# EAGLE board MainLogger (EAGLE 9.6.2), part 1 of 2
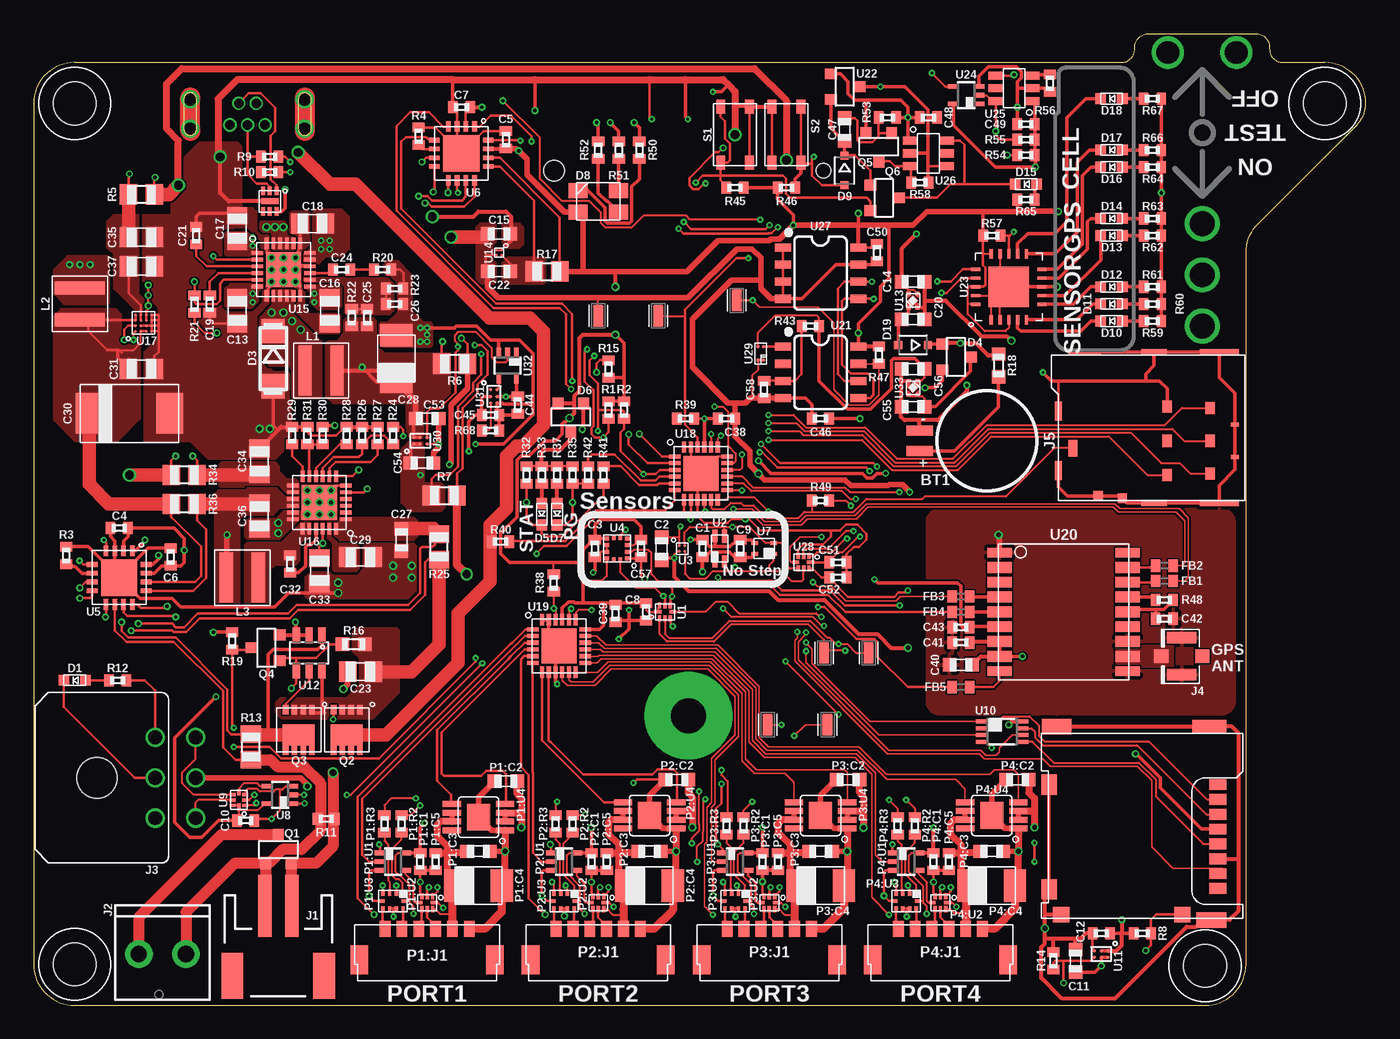
[diagram p7: board, top side]
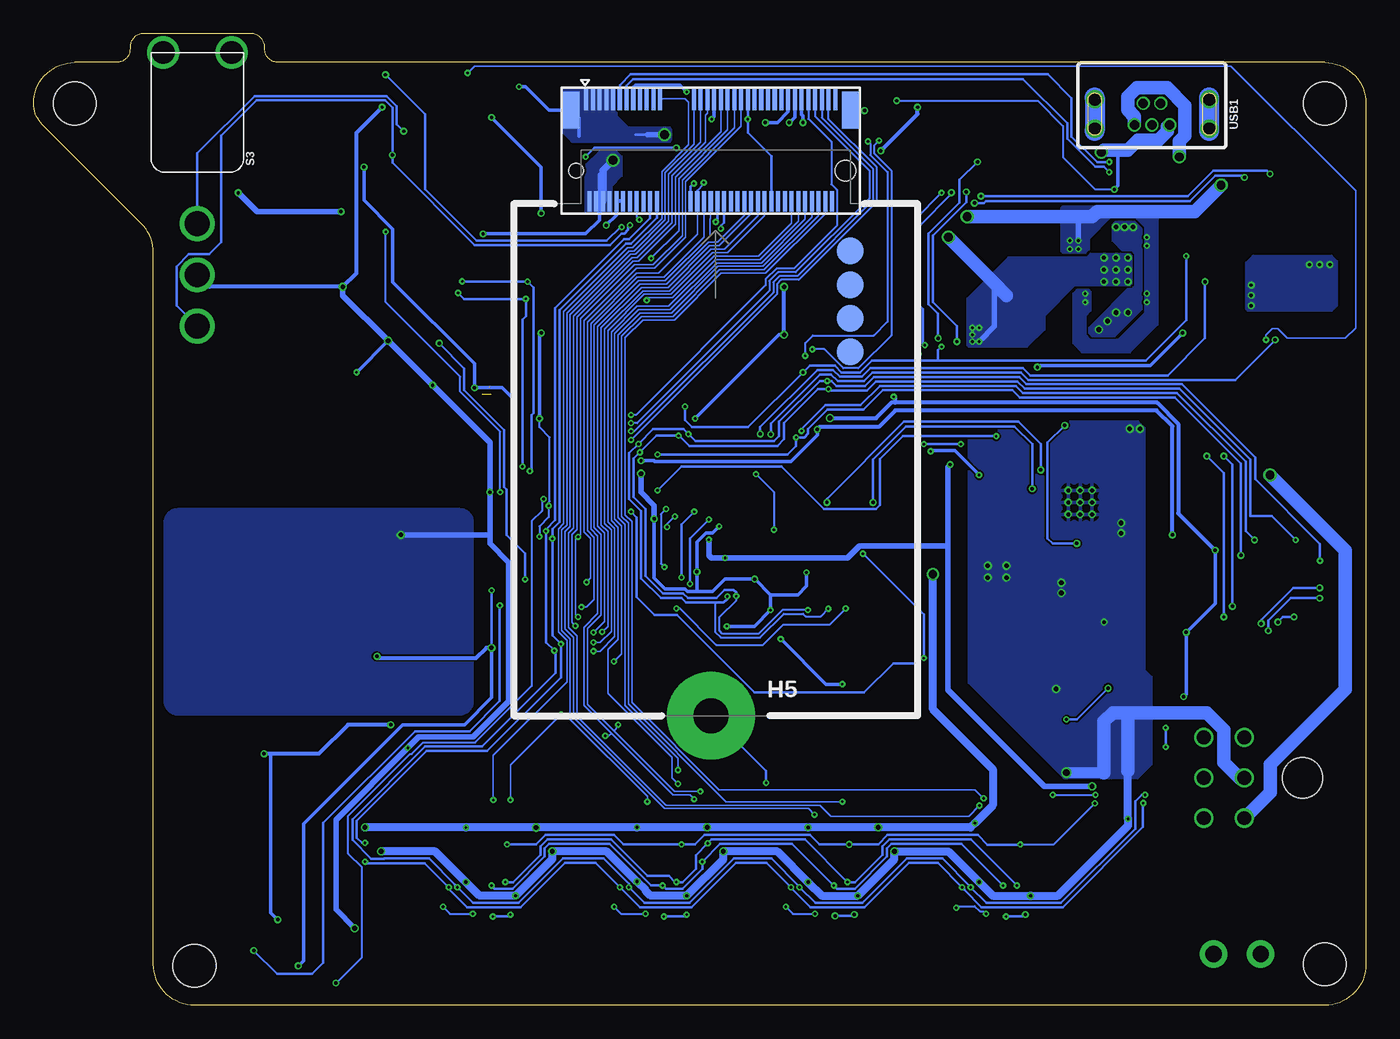
[diagram p8: board, bottom side, seen from below]

Size 98.89 x 72.14 mm. Coordinates in mm from the lower left corner, seen from the top.
Outline: 90.89,58.04 98.25,65.39 arc45 98.89,66.95 arc90 95.84,70 92.74,70 arc-90 91.74,71 91.74,71.14 arc90 90.74,72.14 82.74,72.14 arc90 81.74,71.14 81.74,71 arc-90 80.74,70 3.05,70 arc90 0,66.95 0,3.05 arc90 3.05,0 86.95,0 arc90 90,3.05 90,55.89 arc-45 90.89,58.04
Copper layers (1*16): Top 0.035559375mm / dielectric 1.6mm / Bottom 0.035559375mm
Design rules "jlcpcb-2layer *": minimum track width 5mil, minimum drill 0.2mm, track to track 5mil, track to pad 5mil, pad to pad 5mil, via to via 6mil, smd to smd 5mil, copper to edge 0.2mm, drill to drill 6mil, minimum pad ring 5mil, minimum via ring 5mil, stop-mask expansion 2.5mil, vias tented up to drill 0mil, thermal gap 10mil

## Footprints (pad centres in the part's own frame; a part is rotated, then mirrored left to right if it is on the bottom)
PARTICLE_M.2EKEY = smd 0.3 x 1.55: 1 -9.62,3.735; 2 -9.37,-3.815; 3 -9.12,3.735; 4 -8.87,-3.815; 5 -8.62,3.735; 6 -8.37,-3.815; 7 -8.12,3.735; 8 -7.87,-3.815; 9 -7.62,3.735; 10 -7.37,-3.815; 11 -7.12,3.735; 12 -6.87,-3.815; 13 -6.62,3.735; 14 -6.37,-3.815; 15 -6.12,3.735; 16 -5.87,-3.815; 17 -5.62,3.735; 18 -5.37,-3.815; 19 -5.12,3.735; 20 -4.87,-3.815; 21 -4.62,3.735; 22 -4.37,-3.815; 23 -4.12,3.735; 32 -1.87,-3.815; 33 -1.62,3.735; 34 -1.37,-3.815; 35 -1.12,3.735; 36 -0.87,-3.815; 37 -0.62,3.735; 38 -0.37,-3.815; 39 -0.12,3.735; 40 0.13,-3.815; 41 0.38,3.735; 42 0.63,-3.815; 43 0.88,3.735; 44 1.13,-3.815; 45 1.38,3.735; 46 1.63,-3.815; 47 1.88,3.735; 48 2.13,-3.815; 49 2.38,3.735; 50 2.63,-3.815; 51 2.88,3.735; 52 3.13,-3.815; 53 3.38,3.735; 54 3.63,-3.815; 55 3.88,3.735; 56 4.13,-3.815; 57 4.38,3.735; 58 4.63,-3.815; 59 4.88,3.735; 60 5.13,-3.815; 61 5.38,3.735; 62 5.63,-3.815; 63 5.88,3.735; 64 6.13,-3.815; 65 6.38,3.735; 66 6.63,-3.815; 67 6.88,3.735; 68 7.13,-3.815; 69 7.38,3.735; 70 7.63,-3.815; 71 7.88,3.735; 72 8.13,-3.815; 73 8.38,3.735; 74 8.63,-3.815; 75 8.88,3.735 | smd 1.2 x 2.75: 76 9.98,2.96; 77 -10.72,2.96 | smd 2 x 2: !RESET 10,-7.5; SWCLK 10,-15; SWDIO 10,-12.5; SWO 10,-10 | drill 2.6 pad 6.5: GND -0.351,-42 | hole 1.1: -10.37,-1.54 | hole 1.55: 9.63,-1.54
ML621S = smd 0.75 x 2: + 0.75,1; - -0.75,1
C0402 = smd 0.7 x 0.9: 1 -0.65,0; 2 0.65,0
C0603 = smd 1 x 1: 1 -0.85,0; 2 0.85,0
C0805 = smd 1.3 x 1.5: 1 -0.95,0; 2 0.95,0
C1411_TANT = smd 1.65 x 2.4: ANODE -1.725,0; CATHODE 1.725,0
C2917 = smd 2 x 3: + -3,0; - 3,0
LED_0603 = smd 0.8 x 0.8: ANODE 0.8,0; CATHODE -0.8,0
DFN_6_1.6X1.6 = smd 0.3 x 0.63: 1 -0.5,-0.76; 2 0,-0.76; 3 0.5,-0.76; 4 0.5,0.76; 5 0,0.76; 6 -0.5,0.76 | smd 1.3 x 0.45: EP 0,0
DO214AC = smd 1.8 x 1.7: A 2.05,0; C -2.05,0
SOT23-3 = smd 0.8 x 0.9: 1 -0.95,-1; 2 0.95,-1; 3 0,1.1
CLVBA-FKA = smd 1.4 x 1.1: 1 -1.5,0.8; 2 -1.5,-0.8; 3 1.5,-0.8; 4 1.5,0.8
SOD323-R = smd 0.6 x 0.6: A 1.1,0; C -1.1,0
R0402 = smd 0.7 x 0.9: 1 -0.65,0; 2 0.65,0
4_40 = hole 3.175: 0,0
JST-2-SMD = smd 1 x 4.6: 1 -1,-3.7; 2 1,-3.7 | smd 1.6 x 3.4: NC1 -3.4,1.5; NC2 3.4,1.5
SCREWTERMINAL-3.5MM-2_ROUND_RESTRICT = drill 1.2 pad 2.032: 1 0,0; 2 3.5,0
2X3_MICROFIT_RT = drill 1.02: 1 3,4.32; 2 0,4.32; 3 -3,4.32; 4 3,7.32; 5 0,7.32; 6 -3,7.32 | hole 3: 0,0
U.FL = smd 2.2 x 0.85: 1 0,1.375; 2 0,-1.375 | smd 1.05 x 1: FEED 1.525,0; NC -1.525,0
SIM_SF72 = smd 0.9 x 0.7: 1 2.44,2.6; 2 0,2.6; 3 -2.44,2.6; 5 2.54,5.77; 6 0,5.77; 7 -2.54,5.77 | smd 0.7 x 0.7: CSW -4.27,9.1 | smd 1.2 x 0.65: DSW -0.55,12.775 | smd 0.45 x 2.9: GND@1 -4.62,1.9; GND@8 6.58,1.9 | smd 0.45 x 1.9: GND@2 -4.62,6.75; GND@7 6.58,6.75 | smd 0.75 x 0.7: GND@3 -4.095,10.9 | smd 1.4 x 0.5: GND@4 -2.2,13.85; GND@5 2.2,13.85 | smd 0.45 x 2.4: GND@6 6.58,11.9 | smd 0.3 x 0.6: GND@9 1.22,0.75; GND@10 -1.22,0.75
WE-MAIA(4.1X4.1) = smd 0.98 x 3.7: P$1 -1.185,0; P$2 1.185,0
WE-MAPI(4.1X4.1) = smd 0.98 x 3.7: P$1 -1.185,0; P$2 1.185,0
1X06_MICROLOCKPLUS_RT = smd 0.8 x 1.2: 1 -3.125,-0.6; 2 -1.875,-0.6; 3 -0.625,-0.6; 4 0.625,-0.6; 5 1.875,-0.6; 6 3.125,-0.6 | smd 1.3 x 2.15: BODY@1 -5.025,1.695; BODY@2 5.025,1.695
DCK_R-PDSO-G5 = smd 0.35 x 0.8: 1 -0.65,-0.95; 2 0,-0.95; 3 0.65,-0.95; 4 0.65,0.95; 5 -0.65,0.95
UQFN-8_1.4X1.2 = smd 0.55 x 0.25: 1 -0.53,0 | smd 0.25 x 0.45: 2 -0.4,-0.475; 3 0,-0.475; 4 0.4,-0.475; 6 0.4,0.475; 7 0,0.475; 8 -0.4,0.475 | smd 0.45 x 0.25: 5 0.58,0
MICROPAK_10 = smd 0.25 x 0.35: 1 -0.75,-0.56; 2 -0.25,-0.56; 3 0.25,-0.56; 4 0.75,-0.56; 6 0.75,0.56; 7 0.25,0.56; 8 -0.25,0.56; 9 -0.75,0.56 | smd 0.35 x 0.25: 5 0.81,0; 10 -0.81,0
MSOP_8EP = smd 1.35 x 0.45: 1 -1.975,0.975; 2 -1.975,0.325; 3 -1.975,-0.325; 4 -1.975,-0.975; 5 1.975,-0.975; 6 1.975,-0.325; 7 1.975,0.325; 8 1.975,0.975 | smd 1.7 x 2: EP 0,0
POWERDI3333-8 = smd 0.42 x 0.7: 1 -0.975,-1.5; 2 -0.325,-1.5; 3 0.325,-1.5; 4 0.975,-1.5; EP@1 0.975,1.5; EP@2 0.325,1.5; EP@3 -0.325,1.5; EP@4 -0.975,1.5 | smd 2.37 x 1.55: EP@5 0,0.381
R0805 = smd 1.3 x 1.5: 1 -0.95,0; 2 0.95,0
R0603 = smd 1 x 1: 1 -0.85,0; 2 0.85,0
SWITCH_4.2X3.2 = smd 1.05 x 0.65: 1 -2.075,1.075; 2 2.075,1.075; 3 -2.075,-1.075; 4 2.075,-1.075
7103K2CWAV2 = drill 1.85: 1 0,12.7; 2 0,16.51; 3 0,20.32 | drill 1.7: BODY@1 -2.54,0; BODY@2 2.54,0
MICROSD_MOLEX_5031821852 = smd 0.8 x 1.24: 1 0,-0.62; 2 1.1,-0.62; 3 2.2,-0.62; 4 3.3,-0.62; 5 4.4,-0.62; 6 5.5,-0.62; 7 6.6,-0.62; 8 7.7,-0.62 | smd 0.95 x 2.5: BODY@1 -4.345,-1.24 | smd 1.15 x 2.2: BODY@2 -4.305,-12.58; BODY@5 10.045,-1.1 | smd 1.5 x 1.15: BODY@3 0,-13.155; BODY@4 7.78,-13.155 | smd 1.16 x 1.2: SW1 9.64,-12.25; SW2 9.64,-3.25
TESTPOINT_0603 = smd 1.6 x 0.8: 1 0,0
VEML6075 = smd 0.9 x 0.35: 1 -0.95,0.35; 2 -0.95,-0.35; 4 0.95,0.35 | smd 1 x 0.35: 3 0.9,-0.35
BGA_4 = smd 0.23 x 0.23: A1 -0.2,0.2; A2 0.2,0.2; B1 -0.2,-0.2; B2 0.2,-0.2
LGA-12_2X2 = smd 0.3 x 0.35: 1 -0.75,-0.775; 2 -0.25,-0.775; 3 0.25,-0.775; 4 0.75,-0.775; 7 0.75,0.775; 8 0.25,0.775; 9 -0.25,0.775; 10 -0.75,0.775 | smd 0.3 x 0.25: 5 0.8,-0.25; 6 0.8,0.25; 11 -0.8,0.25; 12 -0.8,-0.25
QFN16 = smd 0.8 x 0.35: 1 -2,0.975; 2 -2,0.325; 3 -2,-0.325; 4 -2,-0.975; 9 2,-0.975; 10 2,-0.325; 11 2,0.325; 12 2,0.975 | smd 0.35 x 0.8: 5 -0.975,-2; 6 -0.325,-2; 7 0.325,-2; 8 0.975,-2; 13 0.975,2; 14 0.325,2; 15 -0.325,2; 16 -0.975,2 | smd 2.7 x 2.7: EP 0,0
SHT4X = smd 0.5 x 0.3: 1 -0.7,0.4; 2 -0.7,-0.4; 3 0.7,-0.4; 4 0.7,0.4
DCU_(R-PDSO-G8) = smd 0.3 x 0.8: 1 -0.75,-1.55; 2 -0.25,-1.55; 3 0.25,-1.55; 4 0.75,-1.55; 5 0.75,1.55; 6 0.25,1.55; 7 -0.25,1.55; 8 -0.75,1.55
WCSP_6 = smd 0.25 x 0.25: A1 -0.25,0.5; A2 0.25,0.5; B1 -0.25,0; B2 0.25,0; C1 -0.25,-0.5; C2 0.25,-0.5
SOT23-6L = smd 0.55 x 1.2: 1 -0.95,-1.3; 2 0,-1.3; 3 0.95,-1.3; 4 0.95,1.3; 5 0,1.3; 6 -0.95,1.3
X2SON = smd 0.28 x 0.31: 1 -0.52,0.325; 2 -0.52,-0.325; 3 0.52,-0.325; 4 0.52,0.325 | smd 0.58 x 0.58 rotated 45: EP 0,0
YKE0004 = smd 0.18 x 0.18: A1 -0.175,0.175; A2 0.175,0.175; B1 -0.175,-0.175; B2 0.175,-0.175
QFN24_POWER = smd 0.85 x 0.28: 1 -1.95,1.25; 2 -1.95,0.75; 3 -1.95,0.25; 4 -1.95,-0.25; 5 -1.95,-0.75; 6 -1.95,-1.25; 13 1.95,-1.25; 14 1.95,-0.75; 15 1.95,-0.25; 16 1.95,0.25; 17 1.95,0.75; 18 1.95,1.25 | smd 0.28 x 0.85: 7 -1.25,-1.95; 8 -0.75,-1.95; 9 -0.25,-1.95; 10 0.25,-1.95; 11 0.75,-1.95; 12 1.25,-1.95; 19 1.25,1.95; 20 0.75,1.95; 21 0.25,1.95; 22 -0.25,1.95; 23 -0.75,1.95; 24 -1.25,1.95 | smd 2.6 x 2.6: EP 0,0 | drill 0.3: EP@1 -0.889,0.889; EP@2 0,0.889; EP@3 0.889,0.889; EP@4 -0.889,0; EP@5 0,0; EP@6 0.889,0; EP@7 -0.889,-0.889; EP@8 0,-0.889; EP@9 0.889,-0.889
YFP0016 = smd 0.23 x 0.23: A1 -0.6,0.6; A2 -0.2,0.6; A3 0.2,0.6; A4 0.6,0.6; B1 -0.6,0.2; B2 -0.2,0.2; B3 0.2,0.2; B4 0.6,0.2; C1 -0.6,-0.2; C2 -0.2,-0.2; C3 0.2,-0.2; C4 0.6,-0.2; D1 -0.6,-0.6; D2 -0.2,-0.6; D3 0.2,-0.6; D4 0.6,-0.6
QFN24 = smd 0.85 x 0.3: 1 -1.95,1.25; 2 -1.95,0.75; 3 -1.95,0.25; 4 -1.95,-0.25; 5 -1.95,-0.75; 6 -1.95,-1.25; 13 1.95,-1.25; 14 1.95,-0.75; 15 1.95,-0.25; 16 1.95,0.25; 17 1.95,0.75; 18 1.95,1.25 | smd 0.3 x 0.85: 7 -1.25,-1.95; 8 -0.75,-1.95; 9 -0.25,-1.95; 10 0.25,-1.95; 11 0.75,-1.95; 12 1.25,-1.95; 19 1.25,1.95; 20 0.75,1.95; 21 0.25,1.95; 22 -0.25,1.95; 23 -0.75,1.95; 24 -1.25,1.95 | smd 2.6 x 2.6: EP 0,0
MAX-M8 = smd 1.8 x 0.7: 1 -4.75,4.4; 9 -4.75,-4.4; 10 4.75,-4.4; 18 4.75,4.4 | smd 1.8 x 0.8: 2 -4.75,3.3; 3 -4.75,2.2; 4 -4.75,1.1; 5 -4.75,0; 6 -4.75,-1.1; 7 -4.75,-2.2; 8 -4.75,-3.3; 11 4.75,-3.3; 12 4.75,-2.2; 13 4.75,-1.1; 14 4.75,0; 15 4.75,1.1; 16 4.75,2.2; 17 4.75,3.3
SO08 = smd 0.6 x 1.2: 1 -1.905,-2.8; 2 -0.635,-2.8; 3 0.635,-2.8; 4 1.905,-2.8; 5 1.905,2.8; 6 0.635,2.8; 7 -0.635,2.8; 8 -1.905,2.8
QFN20_5X5 = smd 0.7 x 0.25: 1 -2.45,1.3; 2 -2.45,0.65; 3 -2.45,0; 4 -2.45,-0.65; 5 -2.45,-1.3; 11 2.45,-1.3; 12 2.45,-0.65; 13 2.45,0; 14 2.45,0.65; 15 2.45,1.3 | smd 0.25 x 0.7: 6 -1.3,-2.45; 7 -0.65,-2.45; 8 0,-2.45; 9 0.65,-2.45; 10 1.3,-2.45; 16 1.3,2.45; 17 0.65,2.45; 18 0,2.45; 19 -0.65,2.45; 20 -1.3,2.45 | smd 3 x 3: EP 0,0
DDC_R-PDSO-G6 = smd 0.6 x 1.1: 1 -0.95,-1.35; 2 0,-1.35; 3 0.95,-1.35; 4 0.95,1.35; 5 0,1.35; 6 -0.95,1.35
LD-4 = smd 0.25 x 0.25: 1 -0.5,-0.205; 2 0.5,-0.205; 3 0.5,0.205; 4 -0.5,0.205
MUSB-K152-30 = drill 0.7: 1 -1.3,0.8; 2 -0.65,-0.8; 3 0,0.8; 4 0.65,-0.8; 5 1.3,0.8 | drill 0.95: BODY@1 -4.25,1.1; BODY@2 -4.25,-1.1; BODY@3 4.25,-1.1; BODY@4 4.25,1.1

## Placement (x,y rotation side)
$3_190_$_2021-12-10_02-09-55  B_SERIES_M.2EKEY_3042  [PARTICLE_M.2EKEY]  48.26,63.5 0 bottom
BT1  BATTERY_COINML621  [ML621S]  64.77,41.91 270 top
C1  0.1uF  [C0402]  49.66,33.91 270 top
C2  2.2uF  [C0603]  46.61,33.91 90 top
C3  0.1uF  [C0402]  41.66,33.91 270 top
C4  0.1uF  [C0402]  6.35,35.43 180 top
C5  0.1uF  [C0402]  35.05,64.26 90 top
C6  0.1uF  [C0402]  10.16,33.27 90 top
C7  0.1uF  [C0402]  31.75,66.67 180 top
C8  0.1uF  [C0402]  45.47,29.21 270 top
C9  0.1uF  [C0402]  52.45,33.91 270 top
C10  0.1uF  [C0402]  15.75,13.72 0 top
C11  1uF  [C0603]  77.34,3.3 90 top
C12  0.1uF  [C0402]  79.25,5.33 180 top
C13  22uF  [C0805]  15.11,51.56 270 top
C14  1uF  [C0603]  65.28,53.72 0 top
C15  1uF  [C0603]  34.54,57.28 180 top
C16  22uF  [C0805]  21.97,51.56 270 top
C17  22uF  [C0805]  15.11,57.66 90 top
C18  22uF  [C0805]  20.7,58.04 180 top
C19  1nF  [C0402]  13.08,52.07 270 top
C20  1uF  [C0603]  65.28,50.93 0 top
C21  10nF  [C0402]  12.06,57.15 90 top
C22  1uF  [C0603]  34.54,54.48 180 top
C23  10uF  [C0805]  24.26,24.77 180 top
C24  39pF  [C0402]  22.86,54.61 0 top
C25  10nF  [C0402]  24.77,51.05 90 top
C26  100pF  [C0402]  26.8,52.07 0 top
C27  1uF  [C0603]  27.3,34.54 270 top
C28  100uF  [C1411_TANT]  26.92,48.01 90 top
C29  10uF  [C0805]  24.26,33.27 0 top
C30  220uF  [C2917]  7.11,43.94 0 top
C31  1.5uF  [C0805]  8,47.24 0 top
C32  47nF  [C0402]  19.05,32.77 270 top
C33  4.7uF  [C0805]  21.21,32.26 270 top
C34  22uF  [C0805]  16.76,40.39 90 top
C35  10uF  [C0805]  8,57.02 0 top
C36  10uF  [C0805]  16.76,36.32 270 top
C37  10uF  [C0805]  8,54.86 0 top
C38  0.1uF  [C0402]  51.44,43.56 0 top
C39  0.1uF  [C0402]  43.18,29.08 270 top
C40  1uF  [C0603]  68.83,25.27 180 top
C41  0.1uF  [C0402]  68.83,26.92 180 top
C42  47pF  [C0402]  83.95,28.7 0 top
C43  0.1uF  [C0402]  68.83,28.07 180 top
C44  0.1uF  [C0402]  35.94,44.58 270 top
C45  0.1uF  [C0402]  33.91,43.81 0 top
C46  0.1uF  [C0402]  58.42,43.56 180 top
C47  1uF  [C0603]  60.2,65.02 90 top
C48  0.1uF  [C0402]  66.42,65.91 0 top
C49  0.1uF  [C0402]  73.66,65.41 180 top
C50  0.1uF  [C0402]  62.61,55.88 270 top
C51  0.1uF  [C0402]  59.69,32.89 0 top
C52  0.1uF  [C0402]  59.69,31.75 0 top
C53  1uF  [C0603]  29.21,43.56 0 top
C54  1uF  [C0603]  28.83,40.26 0 top
C55  1uF  [C0603]  65.28,44.45 180 top
C56  1uF  [C0603]  65.28,47.24 180 top
C57  0.1uF  [C0402]  45.09,33.91 270 top
C58  100pF  [C0402]  54.23,45.72 270 top
D1  LEDRED0603  [LED_0603]  3.05,24.13 0 top
D2  RCLAMP3654  [DFN_6_1.6X1.6]  17.53,59.69 180 top
D3  CDBA3100  [DO214AC]  17.78,48.01 270 top
D4  BAT54C  [SOT23-3]  68.45,48.13 270 top
D5  LEDGREEN0603  [LED_0603]  37.72,36.45 90 top
D6  [SOT23-3]  39.88,43.69 180 top
D7  LEDYELLOW0603  [LED_0603]  38.86,36.45 90 top
D8  CLVBA-FKA  [CLVBA-FKA]  41.91,59.69 0 top
D9  BAT54WS  [SOD323-R]  60.2,61.98 270 top
D10  LEDGREEN0603  [LED_0603]  80.01,50.8 0 top
D11  LEDYELLOW0603  [LED_0603]  80.01,52.07 0 top
D12  LEDRED0603  [LED_0603]  80.01,53.34 0 top
D13  LEDGREEN0603  [LED_0603]  80.01,57.15 0 top
D14  LEDYELLOW0603  [LED_0603]  80.01,58.42 0 top
D15  LEDGREEN0603  [LED_0603]  73.66,60.96 0 top
D16  LEDGREEN0603  [LED_0603]  80.01,62.23 0 top
D17  LEDYELLOW0603  [LED_0603]  80.01,63.5 0 top
D18  LEDRED0603  [LED_0603]  80.01,67.31 0 top
D19  BAT54WS  [SOD323-R]  65.28,49.02 180 top
FB1  [R0402]  83.95,31.5 180 top
FB2  [R0402]  83.95,32.64 180 top
FB3  [R0402]  68.83,30.35 0 top
FB4  [R0402]  68.83,29.21 0 top
FB5  [R0402]  68.83,23.62 180 top
H1  [4_40]  95.84,66.95 0 top
H2  [4_40]  86.95,2.92 0 top
H3  [4_40]  3.05,3.05 0 top
H4  [4_40]  3.05,66.95 0 top
J1  [JST-2-SMD]  18.16,3.68 180 top
J2  [SCREWTERMINAL-3.5MM-2_ROUND_RESTRICT]  11.3,3.81 180 top
J3  GEMS_POWER_PLUGINPUT_RT  [2X3_MICROFIT_RT]  4.7,16.89 270 top
J4  U.FL  [U.FL]  85.22,25.91 180 top
J5  SIM_CDNANO_SF72  [SIM_SF72]  89.92,41.91 90 top
L1  1uH  [WE-MAIA(4.1X4.1)]  21.34,47.12 0 top
L2  0.47uH  [WE-MAPI(4.1X4.1)]  3.43,52.07 90 top
L3  1uH  [WE-MAIA(4.1X4.1)]  15.49,31.75 180 top
P1:C1  0.1uF  [C0402]  28.7,10.67 270 top
P1:C2  2.2uF  [C0603]  35.05,16.64 180 top
P1:C3  1uF  [C0603]  33.02,11.43 0 top
P1:C4  100uF  [C1411_TANT]  33.02,8.89 0 top
P1:C5  0.1uF  [C0402]  29.84,10.67 270 top
P1:J1  CONN_TALON_LOGGER  [1X06_MICROLOCKPLUS_RT]  29.21,5.08 180 top
P1:R2  1k  [R0402]  27.3,13.46 90 top
P1:R3  1k  [R0402]  26.04,13.46 90 top
P1:U1  SN74AUP1G08DCK  [DCK_R-PDSO-G5]  26.67,10.67 270 top
P1:U2  FXMAR2102UMLP  [UQFN-8_1.4X1.2]  29.21,7.62 180 top
P1:U3  FSA2258  [MICROPAK_10]  26.67,7.75 180 top
P1:U4  AP2411  [MSOP_8EP]  33.02,13.97 180 top
P2:C1  0.1uF  [C0402]  41.4,10.67 270 top
P2:C2  2.2uF  [C0603]  47.75,16.76 180 top
P2:C3  1uF  [C0603]  45.72,11.43 0 top
P2:C4  100uF  [C1411_TANT]  45.72,8.89 0 top
P2:C5  0.1uF  [C0402]  42.55,10.67 270 top
P2:J1  CONN_TALON_LOGGER  [1X06_MICROLOCKPLUS_RT]  41.91,5.08 180 top
P2:R2  1k  [R0402]  40.01,13.46 90 top
P2:R3  1k  [R0402]  38.73,13.46 90 top
P2:U1  SN74AUP1G08DCK  [DCK_R-PDSO-G5]  39.37,10.67 270 top
P2:U2  FXMAR2102UMLP  [UQFN-8_1.4X1.2]  41.91,7.62 180 top
P2:U3  FSA2258  [MICROPAK_10]  39.37,7.75 180 top
P2:U4  AP2411  [MSOP_8EP]  45.72,14.1 180 top
P3:C1  0.1uF  [C0402]  54.1,10.67 270 top
P3:C2  2.2uF  [C0603]  60.45,16.76 180 top
P3:C3  1uF  [C0603]  58.42,11.43 0 top
P3:C4  100uF  [C1411_TANT]  58.42,8.89 0 top
P3:C5  0.1uF  [C0402]  55.24,10.67 270 top
P3:J1  CONN_TALON_LOGGER  [1X06_MICROLOCKPLUS_RT]  54.61,5.08 180 top
P3:R2  1k  [R0402]  52.7,13.34 90 top
P3:R3  1k  [R0402]  51.44,13.34 90 top
P3:U1  SN74AUP1G08DCK  [DCK_R-PDSO-G5]  52.07,10.67 270 top
P3:U2  FXMAR2102UMLP  [UQFN-8_1.4X1.2]  54.61,7.62 180 top
P3:U3  FSA2258  [MICROPAK_10]  52.07,7.75 180 top
P3:U4  AP2411  [MSOP_8EP]  58.42,14.1 180 top
P4:C1  0.1uF  [C0402]  66.8,10.67 270 top
P4:C2  2.2uF  [C0603]  73.03,16.76 180 top
P4:C3  1uF  [C0603]  71.12,11.43 0 top
P4:C4  100uF  [C1411_TANT]  71.12,8.89 0 top
P4:C5  0.1uF  [C0402]  67.94,10.67 270 top
P4:J1  CONN_TALON_LOGGER  [1X06_MICROLOCKPLUS_RT]  67.31,5.08 180 top
P4:R2  1k  [R0402]  65.41,13.34 90 top
P4:R3  1k  [R0402]  64.14,13.34 90 top
P4:U1  SN74AUP1G08DCK  [DCK_R-PDSO-G5]  64.77,10.67 270 top
P4:U2  FXMAR2102UMLP  [UQFN-8_1.4X1.2]  67.31,7.62 180 top
P4:U3  FSA2258  [MICROPAK_10]  64.77,7.75 180 top
P4:U4  AP2411  [MSOP_8EP]  71.12,14.1 180 top
Q1  DMG3404  [SOT23-3]  18.16,11.56 0 top
Q2  MOSFET_PCH-DMP3036SFG  [POWERDI3333-8]  23.24,20.45 180 top
Q3  MOSFET_PCH-DMP3036SFG  [POWERDI3333-8]  19.68,20.45 180 top
Q4  DMG3404  [SOT23-3]  17.27,26.54 90 top
Q5  NX2301P  [SOT23-3]  62.74,63.75 180 top
Q6  NX2301P  [SOT23-3]  63.12,59.94 270 top
R1  1M  [R0402]  42.67,44.2 90 top
R2  1M  [R0402]  43.81,44.2 90 top
R3  20k  [R0402]  2.41,33.4 270 top
R4  2k  [R0402]  28.57,64.52 270 top
R5  2m  [R0805]  8,60.2 180 top
R6  10m  [R0805]  31.24,47.62 180 top
R7  10m  [R0805]  30.48,37.85 0 top
R8  100k  [R0402]  82.3,5.33 180 top
R9  27R  [R0402]  17.53,62.99 180 top
R10  27R  [R0402]  17.53,61.85 180 top
R11  1M  [R0402]  21.72,13.84 180 top
R12  1k  [R0402]  6.22,24.13 180 top
R13  2m  [R0805]  16.13,19.18 90 top
R14  100k  [R0402]  75.69,3.3 270 top
R15  100k  [R0402]  42.67,47.24 270 top
R16  470k  [R0603]  23.75,26.8 0 top
R17  10m  [R0805]  38.1,54.48 0 top
R18  750R  [R0603]  71.63,47.5 270 top
R19  1M  [R0402]  14.73,27.05 90 top
R20  20k  [R0402]  25.91,54.61 180 top
R21  100k  [R0402]  11.94,52.07 270 top
R22  10k  [R0402]  23.62,51.05 270 top
R23  2.7k  [R0402]  26.8,53.21 180 top
R24  0R  [R0402]  26.67,42.29 270 top
R25  2m  [R0805]  30.1,34.04 90 top
R26  1M  [R0402]  24.38,42.29 270 top
R27  220R  [R0402]  25.53,42.29 270 top
R28  220R  [R0402]  23.24,42.29 270 top
R29  10k  [R0402]  19.18,42.29 90 top
R30  100k  [R0402]  21.46,42.29 90 top
R31  100k  [R0402]  20.32,42.29 270 top
R32  1M  [R0402]  36.58,39.37 90 top
R33  10k  [R0402]  37.72,39.37 90 top
R34  2m  [R0805]  11.18,39.37 180 top
R35  1M  [R0402]  40.01,39.37 90 top
R36  2m  [R0805]  11.18,37.21 180 top
R37  2.7k  [R0402]  38.86,39.37 90 top
R38  100k  [R0402]  38.61,31.37 90 top
R39  100k  [R0402]  48.39,43.56 0 top
R40  1M  [R0402]  34.67,34.42 180 top
R41  1M  [R0402]  42.29,39.37 270 top
R42  1M  [R0402]  41.15,39.37 270 top
R43  1k  [R0402]  57.66,50.42 180 top
R45  10k  [R0402]  52.07,60.71 0 top
R46  10k  [R0402]  55.88,60.71 180 top
R47  100k  [R0402]  62.74,48.26 90 top
R48  10  [R0402]  83.95,30.1 180 top
R49  100k  [R0402]  58.42,37.47 0 top
R50  5.6k  [R0402]  44.96,63.5 90 top
R51  5.6k  [R0402]  43.43,63.5 90 top
R52  5.6k  [R0402]  41.91,63.5 90 top
R53  100k  [R0402]  63.37,65.91 0 top
R54  1M  [R0402]  73.66,63.12 180 top
R55  1M  [R0402]  73.66,64.26 180 top
R56  130k  [R0402]  75.44,68.45 90 top
R57  100k  [R0402]  71.12,57.15 180 top
R58  11k  [R0402]  65.79,61.09 180 top
R59  220R  [R0402]  83.06,50.8 0 top
R60  220R  [R0402]  83.06,52.07 0 top
R61  220R  [R0402]  83.06,53.34 0 top
R62  220R  [R0402]  83.06,57.15 0 top
R63  220R  [R0402]  83.06,58.42 0 top
R64  220R  [R0402]  83.06,62.23 0 top
R65  10k  [R0402]  73.66,59.82 180 top
R66  220R  [R0402]  83.06,63.5 0 top
R67  220R  [R0402]  83.06,67.31 0 top
R68  5.6k  [R0402]  33.91,42.67 180 top
S1  BUTTON4.2X3.2  [SWITCH_4.2X3.2]  52.07,64.64 90 top
S2  BUTTON4.2X3.2  [SWITCH_4.2X3.2]  55.88,64.64 270 top
S3  SPDT7103K2CWAV2  [7103K2CWAV2]  86.74,70.74 180 bottom
SD1  MICROSDMOLEX_503182  [MICROSD_MOLEX_5031821852]  88.52,16.38 270 top
TP1  TESTPOINT_DNP_RCU  [TESTPOINT_0603]  41.91,51.18 90 top
TP2  TESTPOINT_DNP_RCU  [TESTPOINT_0603]  52.2,52.32 90 top
TP5  TESTPOINT_DNP_RCU  [TESTPOINT_0603]  61.98,26.16 90 top
TP6  TESTPOINT_DNP_RCU  [TESTPOINT_0603]  58.67,26.16 90 top
TP7  TESTPOINT_DNP_RCU  [TESTPOINT_0603]  46.35,51.18 90 top
TP8  TESTPOINT_DNP_RCU  [TESTPOINT_0603]  58.93,20.83 90 top
TP9  TESTPOINT_DNP_RCU  [TESTPOINT_0603]  54.48,20.83 90 top
U1  FXMAR2102UMLP  [UQFN-8_1.4X1.2]  46.86,29.21 0 top
U2  VEML3328  [VEML6075]  50.93,33.91 90 top
U3  MMC5633  [BGA_4]  48.13,33.91 0 top
U4  BMA456  [LGA-12_2X2]  43.31,33.91 90 top
U5  PAC1934QFN  [QFN16]  6.35,31.75 270 top
U6  PAC1934QFN  [QFN16]  31.75,63.25 270 top
U7  SHT40  [SHT4X]  54.23,33.91 180 top
U8  SN74AUP1G08DCK  [DCK_R-PDSO-G5]  18.29,15.62 90 top
U9  FXMAR2102UMLP  [UQFN-8_1.4X1.2]  15.24,15.24 90 top
U10  SN74AUP3G34DCU  [DCU_(R-PDSO-G8)]  71.88,20.32 270 top
U11  TCK111G  [WCSP_6]  79.25,3.81 270 top
U12  LTC4412S6  [SOT23-6L]  20.45,26.16 180 top
U13  TPS7A0331PDQ  [X2SON]  65.28,52.32 90 top
U14  LP59073.3VYKE  [YKE0004]  34.54,55.88 270 top
U15  MIC22602  [QFN24_POWER]  18.54,54.61 0 top
U16  BQ25616  [QFN24_POWER]  21.21,37.34 180 top
U17  TPS61282D  [YFP0016]  8.16,50.65 90 top
U18  PCAL9535AQFN  [QFN24]  49.53,39.5 0 top
U19  PCAL9535AQFN  [QFN24]  38.99,26.67 0 top
U20  MAX-M8W  [MAX-M8]  76.45,29.21 0 top
U21  MCP79412SOIC  [SO08]  58.42,46.99 270 top
U22  HALL_EFFECT_SI7201  [SOT23-3]  60.2,68.2 270 top
U23  PCA9634QFN  [QFN20_5X5]  72.39,53.34 90 top
U24  SN74LVC1G17DCK  [DCK_R-PDSO-G5]  69.22,67.56 90 top
U25  TPL5010DDC  [DDC_R-PDSO-G6]  72.77,68.07 90 top
U26  TPL5010DDC  [DDC_R-PDSO-G6]  66.42,63.25 270 top
U27  MB85RC  [SO08]  58.42,54.36 270 top
U28  FXMAR2102UMLP  [UQFN-8_1.4X1.2]  57.15,32.89 180 top
U29  SIT1552  [LD-4]  53.98,48.39 90 top
U30  TCK111G  [WCSP_6]  28.7,41.91 90 top
U31  FPF2195BUCX  [WCSP_6]  34.16,45.21 0 top
U32  [DCK_R-PDSO-G5]  35.18,47.5 180 top
U33  TPS7A0218PDQ  [X2SON]  65.28,45.85 270 top
USB1  USB_MICROMUSB-K152  [MUSB-K152-30]  15.88,66.17 180 bottom

## Tracks (layer width: path | path; a pad name or v marks a point on that pad's centre or on a via)
3V3_AUX  (via drill 0.2, 0.25, 0.35)
  Top 0.2: R6.1 32.19,49.09 v31.75,49.53 | v28.83,62.61 29.14,62.92 U6.7 | U3.B1 47.81,33.71 47.56,33.47 v47.56,33.21 | 52.2,34.56 C9.1 | U28.8 57.8,32.42 58.47,31.75 C52.1 60.46,30.33 63.89,30.33 64.21,30.64 64.75,30.64 v64.9,30.8
  Top 0.254: U20.8 v73.4,25.91 v73.41,25.91 | C1.1 49.64,34.57 v48.77,34.57 | 49.94,34.73 49.77,34.56 C1.1 | C2.1 46.76,33.21 v47.56,33.21 | 77.6,2.2 C11.1 78.78,2.45 v79.25,2.92 U11.B2 U11.A2 | C1.1 50.16,34.05 50.55,34.05 | 52.2,34.56 51.69,34.05 50.55,34.05 | U7.3 53.28,34.56 C9.1 | U2.4 50.58,34.09 50.55,34.05
  Top 0.305: C40.1 70.32,25.91 U20.8 U20.7 69.57,27.01 C41.1 | v64.91,26.54 63.64,26.54 62.62,27.57 61.23,27.57 58.7,30.1 55.24,30.1 54.61,30.74 48.64,30.74 47.56,31.81 v47.56,33.21
  Top 0.406: v20.32,16.26 20.32,16.38 19.81,16.89 J3.5 | R6.1 32.19,45.77 30.99,44.57 30.99,40.27 v30.86,40.15
  Bottom 0.2: v64.9,30.8 64.9,26.53 | v31.75,49.53 31.75,51.35 32.46,52.06 32.46,57.28 30.16,59.58 30.16,61.28 v28.83,62.61
  Bottom 0.254: v79.25,2.92 78.87,3.3 78.87,13.48 71.52,20.83 66.91,20.83 64.9,22.84 64.9,26.53 v64.91,26.54
  Bottom 0.305: v64.91,26.54 65.29,26.54 66.05,25.78 73.28,25.78 v73.41,25.91
  Bottom 0.406: v48.77,34.57 48.77,33.4 48.58,33.21 v47.56,33.21 38.48,33.21 37.58,34.11 31.09,34.11 31.03,34.16 | v20.32,16.26 23.88,16.26 31.03,23.41 31.03,34.16 | v30.86,40.15 31.03,39.98 31.03,34.16
3V3_AUX_EN  (via drill 0.2, 0.25)
  Top 0.152: v31.5,48.9 31.5,49.1 31.27,49.33 31.27,49.73 31.55,50.01 32.8,50.01 34,48.81 34,48.11 34.36,47.75 35.05,47.75 35.18,47.88 U32.2 | v50.55,44.45 51.18,44.45 51.53,44.1 51.53,41.56 52.11,40.98 52.11,40.39 51.97,40.25 U18.17
  Top 0.2: U15.2 13.6,55.36 v13.34,55.63 | R15.1 42.05,47.89 41.78,47.62 v41.78,46.99 | v31.5,48.9 31.5,48.65 31.32,48.47 31.32,45.5 30.1,44.29 29.47,44.29 29.21,44.03 U30.C2
  Bottom 0.2: v13.34,55.63 13.34,50.88 16.34,47.88 31.75,47.88 | 31.75,47.88 36.66,47.88 37.54,46.99 38.92,46.99 39.42,47.5 41.27,47.5 v41.78,46.99 | v41.78,46.99 41.78,46.98 | v41.78,46.99 | 31.75,47.88 31.75,48.64 v31.5,48.9 | v50.55,44.45 50.55,43.43 50.04,42.93 45.85,42.93 v41.78,46.99
3V3_AUX_PG  (via drill 0.25)
  Top 0.2: U15.5 14.11,53.86 13.84,53.59 13.84,52.32 13.59,52.07 12.06,52.07 11.94,52.2 R21.1 v11.94,53.72 | v44.96,42.42 46.63,40.75 U18.1
  Bottom 0.2: v11.94,53.72 11.94,49.53 14.71,46.76 24.92,46.76 25.45,47.3 36.77,47.3 37.41,46.67 39.05,46.67 39.56,47.17 40.71,47.17 44.96,42.93 v44.96,42.42
3V3_BULK+  (via drill 0.25)
  Top 0.2: v13.59,49.91 12.7,49.91 11.94,50.67 R21.2 | R6.2 30.29,49.22 v30.35,49.28 | v29.65,60.39 29.75,60.48 U6.8
  Top 0.254: C28.ANODE 26.67,46.28 25.47,46.28 v24.38,47.37 | U30.B2 U30.A2 28.2,43.4 C53.1
  Top 0.305: L1.P$2 25.83,47.12 26.67,46.28
  Top 0.406: C28.ANODE 28.36,44.84 C53.1
  Bottom 0.2: v30.35,49.28 30.35,50.42 32.13,52.2 32.13,57.15 29.65,59.63 v29.65,60.39
  Bottom 0.254: v24.38,47.37 24.26,47.5 16,47.5 v13.59,49.91
  pour Top (rank 2, no thermals): 21.84,49.28 22.48,49.28 22.86,49.66 22.86,50.67 23.24,51.05 25.15,51.05 25.4,50.8 25.4,49.02 26.04,48.39 30.86,48.39 30.86,44.7 22.23,44.7 21.72,45.21 21.72,49.15
  pour Top (no thermals): 27.69,44.58 27.69,42.42 27.94,42.16 28.96,42.16 28.96,44.58
3V3_CORE  (via drill 0.2, 0.25, 0.35)
  Top 0.152: C8.1 45.47,29.34 45.59,29.21 U1.1 46.33,29.46 46.46,29.59 U1.8 | U8.5 17.13,14.97 16.64,14.48 15.24,14.48 | 15.24,13.86 15.24,14.48 | 15.24,14.48 U9.1 15.24,14.84 U9.8 | U23.18 69.47,53.34 69.34,53.21 69.34,52.07 | 70.47,55.88 70.56,55.79 U23.15 | U23.3 72.39,50.29 72.14,50.04 70.61,50.04 69.34,51.31 69.34,52.07 | U23.20 69.37,52.04 69.34,52.07 | R49.2 60.28,37.47 v60.66,37.09 | v61.35,34.8 61.22,34.8 60.02,33.6 59.69,33.6 59.04,32.95 C51.1 | R38.2 38.61,32.87 | U4.10 42.53,31.86 42.16,31.5 40.77,31.5 | U4.3 44.56,34.16 44.96,34.56 C57.1
  Top 0.2: U6.14 34.62,62.92 39.05,58.49 39.05,54.61 R17.2 | U6.2 32.08,66.35 C7.1 | R57.2 70.47,55.88 70.47,54.94 70.64,54.77 70.64,53.48 70.5,53.34 U23.18 | 15.24,13.86 C10.1 | U27.8 62.34,56.26 C50.1 | U28.1 C51.1 | C39.1 43.18,29.86 | R39.2 v49.78,43.56
  Top 0.254: U5.2 6.67,34.47 7,34.8 C4.1 10.41,35.43 11.18,34.67 v11.18,33.78 11.18,32.89 10.91,32.62 C6.1 9.51,32.62 8.96,32.08 U5.15 | R53.2 v64.9,65.91 | v64.9,65.91 C48.1 | U26.1 64.9,64.37 v64.9,65.91 | U22.1 59.88,69.15 60.45,68.58 60.45,67.69 60.96,67.18 61.85,67.18 | 61.85,67.18 64.39,67.18 64.9,66.67 v64.9,65.91 | R45.2 R46.2 55.23,59.83 56.39,58.67 v56.39,57.91 | C3.1 41.71,34.66 U4.7 | U21.8 v61.22,49.91 61.22,50.59 62.86,52.24 62.86,53.34 63.5,53.98 63.5,57.91 | R1.2 R2.2 43.81,46.61 | C46.1 v61.34,43.56 | R67.2 R66.2 R64.2 v83.71,60.33 R63.2 R62.2 R61.2 R60.2 R59.2 | C8.1 43.18,29.86 42.29,29.86 | 40.77,32.89 40.74,32.87 38.61,32.87 35.33,32.87 34.67,33.53 34.67,35.05 35.87,36.25 35.87,40.48 36.16,40.77 36.76,40.77 37.91,41.91 38.73,41.91 39.22,42.4 39.22,43.14 39.37,43.29 39.48,43.29 v39.79,43.6 | v13.34,27.69 13.35,27.7 R19.2 | v13.52,22.91 10.47,19.85 10.47,13.59 11.59,12.47 12.47,12.47 13.72,13.72 C10.1 | 61.22,57.91 v61.22,58.8 v61.21,58.8 | 70.48,58.93 70.47,58.91 R57.2 | Q5.2 61.79,67.12 61.85,67.18 | R65.2 73.01,58.94 73.03,58.93 | 41.46,34.6 C3.1 | v43.18,49.78 43.81,49.15 43.81,46.61 | R15.2 42.69,46.61 43.81,46.61 | U31.B2 34.44,45.18 v35.05,45.18 35.81,45.18 35.86,45.23 C44.1 35.83,45.34 U32.5 | 42.29,29.86 40.77,29.86 | 40.77,29.86 40.2,29.86 40.11,29.95 39.69,29.95 39.24,29.5 U19.21 | 40.77,32.89 40.77,31.5 40.77,29.86 | U19.18 42.02,27.92 42.29,28.19 42.29,29.86 | C38.1 v49.78,43.56 U18.21 | C57.1 45.09,35.56 44.58,36.07 42.04,36.07 41.66,35.69 C3.1 | 40.77,32.89 40.77,33.8 41.53,34.56 C3.1
  Top 0.305: C5.1 35.01,63.57 U6.15 | C7.1 v33.27,66.67 | C50.1 62.6,56.52 | R47.2 62.72,48.9 U21.8 | 61.22,57.91 61.21,57.91 U27.8 | v43.18,53.34 43.18,54.48 | v43.18,49.78 40.77,49.78 40.52,49.53 40.52,45.62 40.15,45.25 40.15,44.72 40.13,44.7 | v39.79,43.6 40.13,43.94 40.13,44.7 | D6.2 38.94,44.7 40.13,44.7
  Top 0.406: C5.1 35.82,63.61 v36,63.43 v36.01,63.44 36.64,62.8 36.64,61.66 39.41,58.89 D8.2 40.77,58.53 40.77,54.48 | 40.77,54.48 43.18,54.48 48.51,54.48 50.8,56.77 54.61,56.77 54.74,56.9 55.37,56.9 v56.39,57.91 61.21,57.91 63.5,57.91 65.28,57.91 66.29,58.93 70.48,58.93 73.03,58.93 | 73.01,58.94 76.06,58.94 v76.07,58.93 | 40.77,54.48 39.18,54.48 39.05,54.61
  Bottom 0.152: v61.34,43.56 61.34,42.93 60.58,42.16 60.58,37.4 60.66,37.32 v60.66,37.09 60.66,36.24 61.35,35.55 v61.35,34.8
  Bottom 0.254: v61.22,49.91 61.34,49.79 v61.34,43.56 | v56.39,57.91 55.63,58.67 $3_190_$_2021-12-10_02-09-55.10 | v49.78,43.56 43.56,49.78 v43.18,49.78 | v11.18,33.78 11.18,29.84 v13.34,27.69 13.34,23.1 v13.52,22.91 | v61.21,58.8 61.21,62.23 v64.9,65.91 | v35.05,45.18 34.92,45.05 34.92,44.73
  Bottom 0.305: v36.01,63.44 33.27,66.17 v33.27,66.67 | $3_190_$_2021-12-10_02-09-55.12 $3_190_$_2021-12-10_02-09-55.10 | v43.18,49.78 v43.18,53.34 | v39.79,43.6 36.36,43.6 35.22,44.73 34.92,44.73 15.48,44.73 13.92,43.17 13.92,36.52 v11.18,33.78
  Bottom 0.406: v76.07,58.93 82.31,58.93 v83.71,60.33
3V3_CORE+
  Top 0.152: U14.A2 35.39,55.03
  Top 0.2: 35.39,55.03 C22.1 | R17.1 37.15,59.75 34.63,62.27 U6.13
  pour Top (no thermals): 35.18,55.5 34.8,55.12 34.8,53.85 35.05,53.59 37.85,53.59 37.97,53.72 37.97,55.37 37.85,55.5
3V3_SD  (via drill 0.25)
  Top 0.254: 81.65,5.08 R8.2 80.77,5.33 C12.1 | v81.79,18.67 81.86,18.67 83.64,16.89 83.64,16.13 86.68,13.08 SD1.4 | U11.B1 U11.A1
  Top 0.305: v72.39,20.83 72.63,21.07 U10.8 | U11.A1 80.39,4.06 80.77,4.45 80.77,5.33 v80.77,6.35
  Bottom 0.254: v80.77,6.35 81.28,6.86 81.28,18.67
  Bottom 0.305: v72.39,20.83 75.56,20.83 77.72,18.67 81.28,18.67 v81.79,18.67
3V3_SD_EN  (via drill 0.2, 0.25)
  Top 0.152: v61.03,37.59 60.58,37.59 59.99,38.18 53.27,38.18 52.7,38.75 U18.14
  Top 0.2: R14.2 75.69,3.16 75.83,3.3 76.45,3.3 | U11.C2 78.49,3.3 76.45,3.3 | v76.45,1.65 76.45,3.3
  Bottom 0.152: v76.45,1.65 74.53,3.58 74.53,10.25 75.53,11.25 75.53,14.07 70.95,18.66 70.82,18.66 69.97,19.51 66.11,19.51 61.92,23.7 61.92,35.94 61.16,36.7 61.16,37.47 v61.03,37.59
3V3_TALON  (via drill 0.2, 0.25, 0.35, 0.6)
  Top 0.152: v28.19,6.79 28.19,7.35 27.91,7.63 27.91,7.75 | 27.91,7.75 27.91,8.94 27.21,9.64 27.14,9.64 26.88,9.89 26.88,11.13 27.07,11.32 P1:U1.5 | P1:U3.10 27.91,7.75 | P2:U2.1 42.74,7.62 v43.05,7.31 | v40.89,6.79 40.58,7.11 40.58,7.75 | 40.58,7.75 40.58,8.84 39.58,9.84 39.58,11.13 39.77,11.32 P2:U1.5 | P2:U3.10 40.58,7.75 | P3:U2.1 55.49,7.62 v55.8,7.31 | v53.47,6.79 53.47,7.19 53.29,7.37 53.29,7.75 | 53.29,7.75 53.29,8.94 52.59,9.64 52.54,9.64 52.28,9.89 52.28,11.18 52.42,11.32 P3:U1.5 | P3:U3.10 53.29,7.75 | P4:U2.1 68.19,7.62 v68.5,7.31 | v66.29,6.79 66.29,7.35 66.04,7.61 66.04,7.75 | P4:U1.5 65.17,11.32 64.98,11.13 64.98,9.89 66.04,8.84 66.04,7.75 | P4:U3.10 66.04,7.75 | P1:U2.1 30.02,7.62 v30.4,7.24
  Top 0.2: U6.9 v30.76,60.34 | v32.74,49.02 33.23,49.02 33.7,48.55 33.7,46.83 32.95,46.08 32.95,45.46 31.82,44.33 31.82,39.87 31.43,39.48 31.43,37.97 R7.2
  Top 0.254: P3:U1.5 P3:C1.1 v54.1,13.21 | P4:C1.1 P4:U1.5 | 73.91,16.8 P4:C2.1 | P2:U1.5 P2:C1.1 v41.4,13.21 | P1:U1.5 P1:C1.1 28.7,13.21 v29.02,13.53 | 35.9,16.76 P1:C2.1
  Top 0.305: P4:C1.1 v66.8,13.19
  Top 0.406: P3:U4.3 P3:U4.2 | P4:U4.3 P4:U4.2 | P2:U4.3 P2:U4.2 | P1:U4.3 P1:U4.2
  Top 0.508: P3:C2.1 61.3,15.79 61.59,15.49 61.59,14.35 | P4:C2.1 73.88,15.79 74.3,15.37 74.3,14.48 | P2:C2.1 48.6,15.77 48.9,15.46 48.9,14.35 | P1:U4.3 36.13,14.29 36.2,14.22 | 35.9,16.76 35.9,15.66 36.2,15.36 36.2,14.22 | 61.59,14.35 v61.59,13.19 | P3:U4.3 61.52,14.42 61.59,14.35 | v36.2,13.21 v36.2,13.22 36.2,14.22 | 74.3,14.48 v74.3,13.21 | P4:U4.3 74.24,14.42 74.3,14.48 | 48.9,14.35 v48.9,13.22 v48.9,13.21 | P2:U4.3 48.83,14.42 48.9,14.35
  Top 0.61: v32.13,32 31.43,32.7 31.43,37.97
  Bottom 0.152: v28.19,6.79 28.37,6.97 28.65,6.97 29.05,7.37 30.27,7.37 v30.4,7.24 | v43.05,7.31 42.53,6.79 v40.89,6.79 | v55.8,7.31 55.28,6.79 v53.47,6.79 | v68.5,7.31 67.98,6.79 v66.29,6.79
  Bottom 0.2: v30.76,60.34 30.76,60.25 33.12,57.9 33.12,51.91 32.89,51.69 32.89,49.17 v32.74,49.02
  Bottom 0.61: v74.3,13.21 74.28,13.19 v66.8,13.19 v61.59,13.19 61.58,13.21 v54.1,13.21 v48.9,13.21 v41.4,13.21 v36.2,13.21 29.34,13.21 v29.02,13.53 27.69,14.86 27.69,17.53 32.13,21.97 v32.13,32
3V3_TALON+  (via drill 0.2)
  Top 0.2: U6.10 31.43,60.4 v31.5,60.33 | R7.1 29.53,39.05 29.84,39.37 30.86,39.37 31.49,40 31.49,44.47 32.62,45.59 32.62,46.21 33.22,46.81 v33.22,48.36
  Top 0.254: U31.B1 33.4,45.21 33.26,45.07 C45.1 32.77,43.81 32.3,43.35 v32.3,41.13 | U30.B1 U30.A1 27.98,41.44 C54.1
  Bottom 0.2: v33.22,48.36 33.22,51.55 33.45,51.78 33.45,58.38 v31.5,60.33
  Bottom 0.254: v32.3,41.13 32.25,41.19 30.51,41.19 v28.7,39.38 v28.7,39.37
  pour Top (no thermals): 27.43,41.4 27.81,41.78 28.83,41.78 28.96,41.66 28.96,40.39 28.96,38.86 29.08,38.73 30.1,38.73 30.23,38.73 30.48,38.48 30.48,36.96 30.23,36.7 27.94,36.7 27.3,37.34 27.3,41.27
!CE  (via drill 0.2)
  Top 0.152: v52.58,38.23 51.5,38.23 U18.13
  Top 0.2: R24.1 27.25,42.94 27.43,42.76 v27.43,42.25
  Bottom 0.2: v27.43,42.25 34.36,42.25 36.07,40.54 36.07,37.13 36.37,36.83 40.22,36.83 43.39,40.01 50.8,40.01 v52.58,38.23
!CHG_PG  (via drill 0.25)
  Top 0.2: v24.13,39.75 23.67,39.29 U16.7 | D7.CATHODE 39.5,35.65 40.01,36.16 v40.01,37.34 R35.1 R42.2
  Bottom 0.2: v24.13,39.75 24.13,41.66 25.81,43.34 34.27,43.34 40.01,37.6 v40.01,37.34
!MODE  (via drill 0.2, 0.25)
  Top 0.2: S2.1 S2.2 57.04,62.48 57.78,62.48 | D9.A 58.51,60.88 57.78,61.61 57.78,62.48 | 57.78,62.48 57.78,62.86 v57.91,62.99 | v51.18,63.66 50.85,63.32 50.58,63.32 48.67,61.41 48.67,60.89 48.95,60.61 49.35,60.61 49.76,61.02 v49.88,61.02
  Top 0.254: R46.1 56.53,61.34 56.95,61.77 S2.2
  Bottom 0.2: $3_190_$_2021-12-10_02-09-55.32 50.13,60.77 v49.88,61.02 | v51.18,63.66 57.25,63.66 v57.91,62.99
!RESET  (via drill 0.2)
  Top 0.2: R45.1 51.42,60.83 50.99,61.26 50.99,61.59 | 50.99,61.59 S1.1 51.52,62.57 51.69,62.74 51.69,63.98 51.33,64.34 51.33,65.64 50.99,65.97 S1.2 | 50.99,61.59 55.62,61.59 55.83,61.39 55.83,60.25 56.13,59.94 61.85,59.94 62.12,59.67 Q6.2 | 50.99,61.59 49.66,61.59 v49.15,61.09 | FB5.2 64.89,23.62 62.6,25.91 62.6,27.01 62.42,27.19 61.08,27.19 58.7,29.56 v58.23,29.56
  Bottom 0.127: v58.23,29.56 57.85,29.56 57.28,30.14 57.28,34.75 57.78,35.25 57.78,50.72 54.13,54.37 52.51,54.37 49.63,57.25 $3_190_$_2021-12-10_02-09-55.34
  Bottom 0.2: $3_190_$_2021-12-10_02-09-55.34 49.63,60.48 49.15,60.96 v49.15,61.09
!TALON1_FAULT
  Top 0.2: P1:U4.5 30.99,15 30.99,15.62 29.96,16.65 29.96,20.44 35.24,25.72 35.44,25.92 36.44,26.92 U19.3
!TALON2_FAULT
  Top 0.2: P2:U4.5 42.33,15.07 37.74,19.66 U19.7
!TALON3_FAULT
  Top 0.127: P3:U4.5 56.45,16.53 55.75,17.23 53.51,17.23 52.59,18.15 52.59,23.15 50.26,25.47 42.62,25.47 41.87,24.72 U19.12
!TALON4_FAULT
  Top 0.127: P4:U4.5 69.14,16.07 68.45,16.76 63.33,16.76 61.17,18.92 54.45,18.92 53.6,19.77 53.6,23.57 50.68,26.49 42.37,26.49 41.94,26.92 U19.16
  Top 0.2: 69.09,15.13 P4:U4.5
BAT  (via drill 0.25, 0.65)
  Top 0.2: v9.91,29.62 9.79,29.5 7.96,29.5 7.71,29.75 U5.12 | v10.54,40.77 10.23,40.45 R34.2
  Top 1.016: R34.2 v7.11,39.37
  Bottom 0.2: v10.54,40.77 9.91,40.13 v9.91,29.62
  Bottom 1.016: v7.11,39.37 1.52,33.78 1.52,23.45 7.09,17.88 7.09,15.82 J3.1
BAT_CHG  (via drill 0.25)
  Top 0.2: U5.11 6.67,29.15 6.93,28.9 10.47,28.9 v10.54,28.83 | v11.8,40.77 12.13,40.44 R34.1
  Top 1.016: C34.1 16.7,39.37 R34.1
  Bottom 0.2: v10.54,28.83 10.54,39.51 v11.8,40.77
  pour Top (rank 2, no thermals): 19.68,37.85 18.8,37.85 18.16,38.48 13.97,38.48 13.84,38.61 13.84,40.13 13.97,40.26 17.91,40.26 18.16,40.01 18.16,39.62 18.8,38.99 19.43,38.99 19.68,38.73
BCKP_GPS  (via drill 0.2, 0.25)
  Top 0.254: U20.6 69.53,28.11 C43.1 68.96,28.07 68.83,28.19 68.83,31.11 68.58,31.37 62.66,31.37 v62.41,31.62 | 67.2,49.34 D4.1 66.44,49.08 D19.C
  Top 0.305: R18.1 71.5,48.22 70.87,48.22 69.93,49.15 v68.79,49.15 67.52,49.15 D4.1
  Bottom 0.2: v62.41,31.62 62.41,33.55 63.78,34.93 63.78,38.3 63.96,38.48 63.96,42.72 66.93,45.69 66.93,47.29 v68.79,49.15
BCKP_GPS_REG
  Top 0.254: U13.1 64.95,51.45 C20.1 64.18,50.68 D19.A
BCKP_PRIME  (1 unrouted)
  Top 0.152: 66.13,44.61 C55.1 66.13,45.06 65.98,45.2 65.08,45.2 U33.3
  Top 0.254: D4.3 69.55,47.07 66.93,44.45 C55.1
BCKP_RTC
  Top 0.2: C58.1 55.6,46.37 U21.3 56.52,46.35 57.01,46.85 R43.2
BTST
  Top 0.254: U16.21 20.96,34.55 20.57,34.16 20.32,34.16 20.18,34.02 20.18,32.63 19.67,32.12 C32.2
CHG_SOURCE  (via drill 0.2)
  Top 0.2: Q4.3 16.03,26.4 R19.1 14.73,20.73 v14.86,20.61 | v37.34,33.53 37.9,34.09 39.56,34.09 41.89,36.42 47.96,36.42 48.28,36.74 U18.7 | v32.81,25.78 32.81,25.53 25.63,18.34 18.36,18.34 17.53,19.18 v14.86,19.18
  Bottom 0.2: v14.86,20.61 v14.86,19.18 | v37.34,33.53 32.81,29.01 v32.81,25.78
CHG_STAT  (via drill 0.25)
  Top 0.2: v24.77,38.35 24.5,38.09 U16.5 | R32.1 v36.58,37.34 36.58,36.16 37.08,35.65 D5.CATHODE 37.72,35.05 37.97,34.8 39.24,34.8 42.29,37.85 R41.2
  Bottom 0.2: v24.77,38.35 24.77,41.67 26.08,42.98 34.12,42.98 36.58,40.53 v36.58,37.34
CLK_OSC
  Top 0.2: U29.2 U21.1
COMP
  Top 0.2: C24.1 21.96,54.36 U15.15
CSA_EN  (via drill 0.2, 0.25)
  Top 0.152: v52.58,40.89 52.58,39.88 52.45,39.75 U18.16
  Top 0.2: U6.16 35.94,64.22 35.95,64.2 v36.13,64.2 | R1.1 42.67,42.55 v42.29,42.16 41.66,42.16 41.4,42.42 41.4,42.84 41.55,42.99 41.55,45.66 40.89,46.32 40.89,48.51 v41.09,48.7
  Top 0.254: U5.16 8.85,32.73 9.27,33.15 v9.27,33.4
  Bottom 0.152: v36.13,64.2 36.5,63.84 36.5,63.25 35.23,61.98 35.23,49.73 37.67,47.3 38.79,47.3 40.2,48.7 v41.09,48.7
  Bottom 0.2: v9.27,33.4 9.27,40.21 14.19,45.13 25.7,45.13 26.23,45.66 35.84,45.66 37.28,44.22 39.97,44.22 41.4,42.79 41.4,42.45 41.68,42.16 v42.29,42.16 42.29,41.52 42.92,40.89 v52.58,40.89
D+  (via drill 0.2)
  Top 0.2: v19.05,62.61 19.05,62.63 18.68,62.99 R9.1
  Bottom 0.2: $3_190_$_2021-12-10_02-09-55.11 55.38,68.32 54.58,69.12 23.61,69.12 21.84,67.35 21.84,64.49 19.95,62.59 19.33,62.59 19.31,62.61 v19.05,62.61
D+_IN
  Top 0.2: D2.2 17.53,60.77 17.28,61.02 16.55,61.02 15.88,61.69 15.88,62.99 | R9.2 15.88,62.99 | 15.88,62.99 USB1.3
D-  (via drill 0.2)
  Top 0.2: v19.05,61.85 R10.1
  Bottom 0.2: $3_190_$_2021-12-10_02-09-55.13 54.88,68.27 54.38,68.77 25.46,68.77 22.17,65.48 22.17,64.35 20.08,62.26 19.46,62.26 v19.05,61.85
D-_IN
  Top 0.2: D2.1 18.03,60.9 17.78,61.15 17.72,61.15 17.57,61.29 17.57,61.85 | 17.57,61.85 17.57,64.56 17.92,64.91 17.92,66.62 16.83,67.71 15.97,67.71 USB1.2 | R10.2 17.57,61.85
DELAY
  Top 0.2: C21.1 12.06,55.63 12.83,54.86 U15.3
EN_MAIN  (via drill 0.2)
  Top 0.152: v7.41,49.4 7.41,49.9 U17.A1
  Top 0.2: v66.67,69.22 67.68,68.21 U24.4
  Bottom 0.127: v66.67,69.22 66.15,69.74 10.03,69.74 0.76,60.47 0.76,50.29 1.52,49.53 5.81,49.53 6.54,50.25 6.93,50.25 7.41,49.77 v7.41,49.4
EN_MAIN_OD  (via drill 0.25)
  Top 0.152: U24.2 70.72,67.56 71.17,67.12 U25.6
  Top 0.2: U25.6 v71.42,64.9 71.42,64.6 71.75,64.26 R55.2
  Bottom 0.2: v71.42,64.9 71.94,65.41 71.94,66.77 72.68,67.51 82.48,67.51 86.74,63.25 S3.1
FAULT_BUS
  Top 0.2: D1.ANODE R12.2
FB
  Top 0.2: R23.2 C26.1 | R22.1 C25.2
  pour Top (no thermals): 20.07,53.98 26.29,53.98 26.67,53.59 26.67,51.56 26.42,51.31 23.24,51.31 23.11,51.44 23.11,53.34 22.73,53.72 20.19,53.72 20.07,53.85
GND  (via drill 0.2, 0.25, 0.35, 0.5, 0.65)  (1 unrouted)
  Top 0.152: U14.B2 33.61,55.7 | U1.4 47.26,28.31 v47.44,28.14 | 18.29,16.02 17.99,16.02 17.83,15.87 16.78,15.87 16.57,16.08 15.9,16.08 15.71,15.89 U9.4 | v17.65,13.84 18.29,14.48 18.29,16.02 | 55.5,45.09 U21.4 | U23.19 71.5,52.69 | 71.5,52.69 71.74,52.69 | 71.74,52.69 72.33,53.28 | 72.33,53.28 U23.EP | 71.09,52.04 71.74,52.69 | U23.1 71.09,52.28 71.5,52.69 | U23.2 71.74,52.69 | U23.14 71.74,53.86 72.33,53.28 | TP1.1 41.91,52.53 | U8.3 18.73,16.27 18.48,16.02 18.29,16.02 | U3.A1 47.93,34.8 | 47.93,34.8 47.93,35.49 v48.01,35.56 | C2.2 47.89,34.76 47.93,34.8 | U4.8 U4.9 42.06,33.66 C3.2 | U29.4 53.77,47.17 53.34,46.74 53.34,45.09
  Top 0.2: U16.6 22.46,38.59 U16.EP@7 | C19.2 13.08,50.91 13.38,50.61 C13.2 | R20.1 27.19,54.61 27.45,54.36 R23.1 | U15.EP@5 U15.EP@8 | U15.EP@5 U15.EP@9 | U15.EP@5 U15.EP@4 | U15.EP@5 U15.EP@2 | U15.EP@5 U15.EP@3 | U15.24 17.29,55.86 U15.EP@1 | U15.19 19.68,56.45 19.68,56.03 18.54,54.89 U15.EP@5 | U15.7 17.4,52.77 17.4,53.19 18.54,54.33 U15.EP@5 | U15.EP@5 19.79,53.36 U15.12 | U17.B2 U17.C2 U17.D2 | U17.D2 U17.D3 | U17.D3 U17.D4 9.27,51.25 9.27,50.85 | U17.D2 U17.D1 9.27,50.05 | C31.2 8.95,48.19 9.27,48.51 9.27,50.05 | 9.27,50.05 9.27,50.45 | 9.27,50.45 9.27,50.85 | U17.D3 9.27,50.85 | U17.D2 9.27,50.45 | 33.61,55.7 33.53,55.63 33.53,54.65 C22.2 | S1.4 S1.3 | S2.3 S2.4 | R4.1 29.83,65.17 U6.EP | U6.EP 31.43,63.57 U6.3 31.43,66.35 C7.2 | C5.2 33.42,64.91 U6.EP | P3:U3.5 50.8,7.75 v50.42,8.13 50.42,9.91 50.55,10.03 51.1,10.03 P3:U1.3 | P4:U2.4 66.8,8.2 v66.8,9.14 P4:C1.2 | P4:U3.5 63.5,7.75 v63.12,8.13 63.12,9.91 63.25,10.03 63.8,10.03 P4:U1.3 | P2:U2.4 41.4,8.2 v41.4,9.14 P2:C1.2 | P2:U1.3 37.83,10.02 37.72,9.91 v37.72,8.13 38.1,7.75 P2:U3.5 | P1:U2.4 28.7,8.2 v28.7,9.14 P1:C1.2 | P1:U1.3 25,10.02 24.89,9.91 v24.89,8.13 25.27,7.75 P1:U3.5 | C10.2 16.52,13.84 v17.65,13.84 | P3:U2.4 54.1,8.21 v54.1,9.18 | D1.CATHODE 2.25,22.14 7.5,16.89 J3.2 | v45.88,65.79 45.72,65.95 45.72,68.73 | P2:C2.2 44.77,16.76 v44.52,16.51 | R31.1 20.32,42.55 20.57,42.29 22.46,42.29 23.11,42.94 R28.1 | U27.1 U27.2 U27.3 U27.4 | R11.1 22.23,13.84 | J5.GND@5 76.07,46.35 | U28.4 56.75,33.83 57.14,34.21 58.59,34.21 59.18,34.8 59.18,35.26 | 59.18,35.26 53.94,35.26 53.09,36.11 v52.83,36.11 51.79,36.11 51.49,35.81 49.78,35.81 49.28,36.32 U18.9 49.28,39.25 U18.EP
  Top 0.2: C52.2 C51.2 60.34,33.49 60.88,34.04 61.26,34.04 61.83,34.6 61.83,35 61.14,35.68 60.29,35.68 59.86,35.26 59.18,35.26 | U29.4 U29.1 | U30.C1 v30.06,41.66 | U11.C1 78.6,4.21 C12.2 | U18.18 50.78,40.75 U18.EP | U18.24 U18.23 48.78,40.25 U18.EP | U26.4 66.47,62.3 66.4,62.23 | v45.36,31.65 45.09,31.93 C57.2 44.98,33.16 U4.1
  Top 0.254: C6.2 9.97,33.93 8.51,33.93 6.35,31.77 U5.EP | v22.61,30.61 18.92,30.61 17.88,29.57 10.92,29.57 10.29,30.2 7.9,30.2 U5.EP | C21.2 12.06,58.55 12.32,58.8 14.92,58.8 C17.2 | C4.2 5.7,34.8 6.03,34.47 U5.3 6.03,32.08 U5.EP | R29.2 R31.1 | R58.1 66.4,61.12 66.4,62.23 66.4,63.25 | 66.4,65.91 66.4,63.25 | U26.2 66.4,63.25 | C48.2 66.4,65.91 | U22.3 v62.87,68.2 64.68,68.2 66.4,66.48 66.4,65.91 | C50.2 62.37,54.99 U27.7 59.56,54.99 57.02,52.45 U27.4 | v75.95,53.34 U23.8 U23.EP | C46.2 57.77,44.59 57.28,45.09 U21.4 | P4:C1.2 P4:C5.2 | P2:C1.2 P2:C5.2 | v44.2,29.34 44.2,28.57 | 44.2,28.57 44.2,27.95 v43.43,27.19 | 44.2,28.57 44.21,28.56 C8.2 | SD1.BODY@4 SD1.BODY@3 | P3:C1.2 v54.1,9.18 | P1:C1.2 P1:C5.2 | v48.56,65.79 48.39,65.96 48.39,68.73 | v37.21,66.42 37.21,68.73 | 31.11,68.73 31.1,68.72 C7.2 | v50.42,67.82 51.05,67.82 51.57,68.34 | 52.15,66.72 52.07,66.8 | v71.12,19.11 71.12,19.16 70.71,19.57 U10.4 | U5.EP 4.05,34.05 R3.1 | D3.A 17.78,43.05 18.13,42.7 | U15.19 19.79,58 C18.2 | R56.1 75.17,68.07 U25.2 73.03,68.07 v73.03,66.67 | U24.3 70.17,68.97 70.86,69.67 72.94,69.67 73.3,69.31 73.3,68.87 73.03,68.59 v73.03,66.67 | C49.2 73.03,65.42 v73.03,66.67 | J5.GND@6 J5.GND@7 | v74.93,46.99 75.56,46.35 76.07,46.35 82.55,46.35 | J5.GND@7 J5.GND@8 88.02,46.6 89.17,45.45 J5.GND@9 J5.GND@10 89.17,39.76 88.01,38.61 J5.GND@1 J5.GND@2 81.17,37.29 J5.CSW 80.64,37.81 J5.GND@3 76.74,37.81 76.07,38.49 J5.GND@4 | 82.55,46.35 83.57,46.35 84.15,45.77 J5.5 | 82.55,46.35 82.55,46.86 83.17,47.48 J5.GND@7 | C1.2 49.78,33.26 50.19,33.66 50.55,33.66 | 50.55,33.66 51.67,33.66 52.07,33.26 C9.2 53.28,33.26 U7.4 | U2.1 50.58,33.63 50.55,33.66
  Top 0.254: v29.21,50.29 31.24,50.29 31.37,50.42 32.89,50.42 33.91,49.4 34.54,49.4 | C45.2 35.83,43.81 C44.2 | R68.1 C45.2 | 37.08,44.58 37.08,48.39 36.07,49.4 34.54,49.4 | 37.08,44.58 37.08,43.84 34.9,41.66 v32.81,41.66 | C45.2 34.41,43.96 U31.C2 34.79,44.71 34.88,44.62 37.04,44.62 37.08,44.58 | C39.2 43.32,28.57 44.2,28.57 | v38.86,23.84 38.74,23.96 U19.9 38.74,26.42 U19.EP 38.24,27.42 U19.23 U19.24 | 34.54,49.4 34.53,49.39 U32.3 | 65.18,45.94 U33.EP 65.09,45.85 | 65.02,45.91 64.95,45.99 U33.2 64.94,46.35 64.43,46.35 | U13.EP 65.6,52 U13.2 65.61,51.82 66.13,51.82 | v41.53,32.13 41.66,32.26 C3.2
  Top 0.305: 17.02,41.34 C34.2 18.13,42.7 18.37,42.94 R29.2 | U12.2 U12.3 | U12.3 18.3,27.46 Q4.2 | U12.3 19.5,28.38 v19.43,28.45 | U15.16 18.79,54.86 U15.EP@5 | SD1.BODY@2 87.24,20.69 SD1.BODY@1 88.9,20.73 89.41,20.22 89.41,10.88 | 89.41,10.88 89.41,6.99 88.76,6.34 SD1.BODY@5 86.78,6.34 86.29,5.84 85.6,5.84 80.29,0.53 76.3,0.53 74.8,2.03 74.8,4.32 75.06,4.57 75.06,4.95 | SD1.6 89.41,10.88 | 75.06,6.73 v75.06,5.71 75.06,4.95 | 75.06,6.73 75.06,8.3 SD1.BODY@4 | D2.EP 14.48,59.69 13.84,60.33 13.84,62.87 v13.84,62.99 | R28.1 R26.1 R27.1 | 52.07,66.8 53.06,66.8 S1.4 S2.3 | P3:C5.2 P3:C1.2 | v49.66,32.18 C1.2 | SD1.SW1 76.26,6.73 75.06,6.73 | C12.2 78.09,5.33 77.71,4.95 77.34,4.95 | 77.34,4.95 75.69,4.95 | 75.69,4.95 75.06,4.95 | R14.1 75.69,4.95 | C11.2 77.34,4.95 | C56.2 64.43,46.35 C55.2 64.39,44.41 64.39,43.69 64.64,43.43 65.79,43.43 | C14.2 66.13,52.32 | 66.13,52.32 66.13,51.82 C20.2 | v69.28,46.04 69.28,45.59 67.12,43.43 65.79,43.43 | BT1.- 65.77,43.42 65.79,43.43 | v72.58,49.34 72.24,49.68 70.34,49.68 67.7,52.32 66.13,52.32
  Top 0.406: C23.2 23.31,23.82 v22.99,23.5 | C22.2 33.69,53.32 34.49,52.53 41.91,52.53 48.59,52.53 52.2,56.13 53.34,56.13 53.98,55.5 53.98,53.85 | U27.4 54.74,52.45 53.98,53.21 53.98,53.85 | v71.63,34.92 71.7,34.85 U20.1 | 53.98,53.85 51.82,53.85 48.9,50.93 48.9,47.37 51.55,44.72 52.07,44.72 | P3:U4.1 59.4,13.12 P3:U4.EP 58.42,15.58 P3:C2.2 | P3:C3.2 v60.4,11.43 | P4:C3.2 v73.09,11.43 | P4:U4.1 72.09,13.12 P4:U4.EP 71.12,15.71 P4:C2.2 | P2:C3.2 v47.7,11.43 | P2:C2.2 45.72,15.58 P2:U4.EP 46.7,13.12 P2:U4.1 | P1:C3.2 v34.99,11.43 | P1:C2.2 33.02,15.46 P1:U4.EP 33.99,12.99 P1:U4.1 | 53.2,45.09 52.83,44.72 52.07,44.72 | 53.2,45.09 53.34,45.09 | v65.02,38.1 65.02,38.16 64.5,38.68 63.51,38.68 63.41,38.58 60.68,38.58 60.24,39.02 54.26,39.02 v53.8,39.47 53.16,40.11 53.16,41.13 52.07,42.23 52.07,43.58 | C54.2 29.68,41.02 30.06,41.4 v30.06,41.66 C53.2 | C38.2 52.07,43.58 | 52.07,43.58 52.07,44.72 | U21.4 55.6,45.07 C58.2 53.21,45.07 53.2,45.09
  Top 0.508: P3:U4.1 v60.4,11.43 60.4,9.14 P3:C4.CATHODE | P4:C4.CATHODE 73.09,9.14 v73.09,11.43 P4:U4.1 | P2:U4.1 v47.7,11.43 47.7,9.14 P2:C4.CATHODE | P1:C4.CATHODE 34.99,8.89 v34.99,11.43 P1:U4.1 | v52.07,64.64 52.07,66.8 52.07,67.84 51.57,68.34 51.18,68.73 48.39,68.73 45.72,68.73 37.21,68.73 31.11,68.73 15.11,68.73 13.68,67.3 13.68,63.03 13.84,62.87
  Top 0.61: P3:C4.CATHODE 60.15,7.19 58.64,5.68 P3:J1.1 | P4:C4.CATHODE 72.84,7.19 71.34,5.68 P4:J1.1 | P2:C4.CATHODE 47.45,7.06 46.07,5.68 P2:J1.1 | P1:C4.CATHODE 34.74,6.93 33.49,5.68 P1:J1.1
  Top 0.813: v22.23,17.27 22.23,13.84 22.23,11.81 20.97,10.56 Q1.2 19.16,10.51 J1.1
  Top 1.016: C15.2 33.44,57.02 v30.99,57.02
  Bottom 0.2: 53.34,64.64 54.23,64.64 | $3_190_$_2021-12-10_02-09-55.56 44.13,63.05 45.88,64.8 v45.88,65.79 $3_190_$_2021-12-10_02-09-55.49 | v44.52,16.51 44.52,17.41 $3_190_$_2021-12-10_02-09-55.GND | v32.81,41.66 v30.06,41.66
  Bottom 0.254: v47.44,28.14 45.4,28.14 v44.2,29.34 44.2,30.48 | v43.43,27.19 40.08,23.84 v38.86,23.84 | $3_190_$_2021-12-10_02-09-55.76 37.25,66.46 v37.21,66.42 | $3_190_$_2021-12-10_02-09-55.15 54.38,68.17 54.23,68.33 52.83,68.33 | 52.83,68.33 50.93,68.33 v50.42,67.82 | 58.42,64.52 58.42,65.9 $3_190_$_2021-12-10_02-09-55.77 60.63,66.46 62.37,68.2 v62.87,68.2 | $3_190_$_2021-12-10_02-09-55.39 48.38,65.97 v48.56,65.79 | $3_190_$_2021-12-10_02-09-55.21 52.88,68.28 52.83,68.33 | v72.58,49.34 v74.93,46.99 | v52.83,36.11 52.83,31.74 52.01,30.92 50.52,30.92 50.34,30.74 49.66,30.74 | 49.66,30.74 48.49,30.74 47.58,31.65 v45.36,31.65 44.2,30.48 | 49.66,30.74 v49.66,32.18 49.66,34.4 48.98,35.08 48.49,35.08 v48.01,35.56 | v41.53,32.13 41.53,31.11 42.16,30.48 44.2,30.48
  Bottom 0.305: v73.03,66.67 74.93,64.77 74.93,54.36 v75.95,53.34 85.85,53.34 S3.2
  Bottom 0.406: v75.06,5.71 76.45,7.11 76.45,13.78 v71.12,19.11 70.32,19.91 66.28,19.91 63.63,22.57 63.63,32.89 65.02,34.29 65.02,34.92 | v52.07,64.64 53.34,64.64 | v28.7,49.28 27.56,50.42 27.56,53.59 27.62,53.66 | v52.83,36.11 52.83,37.12 53.8,38.09 v53.8,39.47 | 65.02,34.92 v65.02,38.1 65.02,41.78 v69.28,46.04 v72.58,49.34 75.95,52.7 v75.95,53.34 | v71.63,34.92 65.02,34.92
  Bottom 0.61: 17.65,17.4 v17.65,13.84 17.65,13.34 22.86,8.13 v24.89,8.13 27.69,8.13 v28.7,9.14 30.99,11.43 v34.99,11.43 34.99,10.85 v37.72,8.13 40.39,8.13 v41.4,9.14 43.69,11.43 v47.7,11.43 47.7,10.85 v50.42,8.13 53.1,8.13 53.45,8.48 53.45,8.52 v54.1,9.18 56.35,11.43 v60.4,11.43 60.4,10.85 v63.12,8.13 65.79,8.13 v66.8,9.14 69.09,11.43 v73.09,11.43
  Bottom 0.813: 19.43,17.27 v22.23,17.27
  Bottom 1.016: 17.78,21.72 11.81,21.72 10.54,20.45 10.54,18.03 9.4,16.89 J3.2 | 17.78,21.72 18.8,21.72 19.43,21.08 19.43,17.27 | 17.65,17.4 17.65,21.59 17.78,21.72 | v30.99,57.02 27.62,53.66 26.67,52.7 | v13.84,62.99 13.84,64.16 13.43,64.57 13.43,66.79 14.75,68.12 17,68.12 17.68,67.44 17.68,66.49 17.18,65.99 USB1.5
  other vias: 17.53,42.8 16.76,42.8 18.16,35.05 18.16,35.81 28.07,31.75 26.67,31.75 28.07,32.64 26.67,32.64 22.61,31.37 28.7,50.29 29.21,49.78 29.21,49.28
  pour Top (rank 2, no thermals): 20.32,36.83 20.32,35.94 19.56,35.94 18.16,34.54 16,34.54 15.75,34.8 15.75,35.81 16,36.07 18.03,36.07 18.8,36.83
  pour Top (no thermals): 17.91,40.64 18.16,40.89 18.16,42.93 17.91,43.18 13.97,43.18 13.72,42.93 13.72,40.89 13.97,40.64
  pour Top (rank 2, no thermals): 28.45,34.04 28.19,34.29 24.77,34.29 24.51,34.04 24.51,32.38 24,31.88 22.23,31.88 21.97,32.13 20.57,32.13 20.19,31.75 20.19,30.35 20.32,30.23 27.81,30.23 28.45,30.86
  pour Bottom (rank 2): 16.43,24.89 15.92,24.38 15.92,17.89 16.92,16.89 22.43,16.89 29.46,23.92 29.46,42.83 28.94,43.35 16.93,43.35 16.43,42.85
  pour Top (no thermals): 14.22,51.31 14.35,51.44 16.26,51.44 17.02,52.2 17.02,53.09 17.27,53.34 17.53,53.34 17.53,52.2 16.51,51.18 16.51,50.16 16.26,49.91 14.35,49.91 14.22,50.04
  pour Top (no thermals): 18.8,46.99 17.4,46.99 16.51,47.88 16.51,50.16 14.35,50.16 14.22,50.04 14.22,48.01 14.61,47.62 15.11,47.62 15.88,46.86 15.88,45.72 16.76,44.83 18.67,44.83 18.92,45.09 18.92,46.86
  pour Top (no thermals): 19.56,53.09 19.56,51.44 21.08,49.91 22.61,49.91 22.73,50.04 22.73,51.18 22.61,51.31 20.45,51.31 20.07,51.69 20.07,52.96 19.94,53.09 19.94,53.47 19.81,53.59 19.43,53.59 19.43,53.21
  pour Top (no thermals): 14.35,59.18 14.35,58.04 14.61,57.78 15.88,57.78 16.89,56.77 16.89,56.26 17.27,55.88 17.53,55.88 17.53,57.02 17.4,57.15 16.89,57.15 16.51,57.53 16.51,58.93 16.26,59.18
  pour Top (no thermals): 19.05,58.8 19.05,57.4 19.18,57.28 19.43,57.28 19.56,57.15 19.56,55.88 19.68,55.75 20.45,56.52 20.45,58.8 20.32,58.93 19.18,58.93
  pour Bottom (no thermals): 17.4,55.63 17.53,55.75 20.45,55.75 20.7,55.5 26.54,55.5 29.59,52.45 29.59,49.02 29.46,48.9 25.15,48.9 23.88,50.16 23.88,51.18 21.59,53.47 17.53,53.47 17.4,53.59